# EAGLE schematic 2ndNov_submission_12V_everywhere (EAGLE 8.3.2)
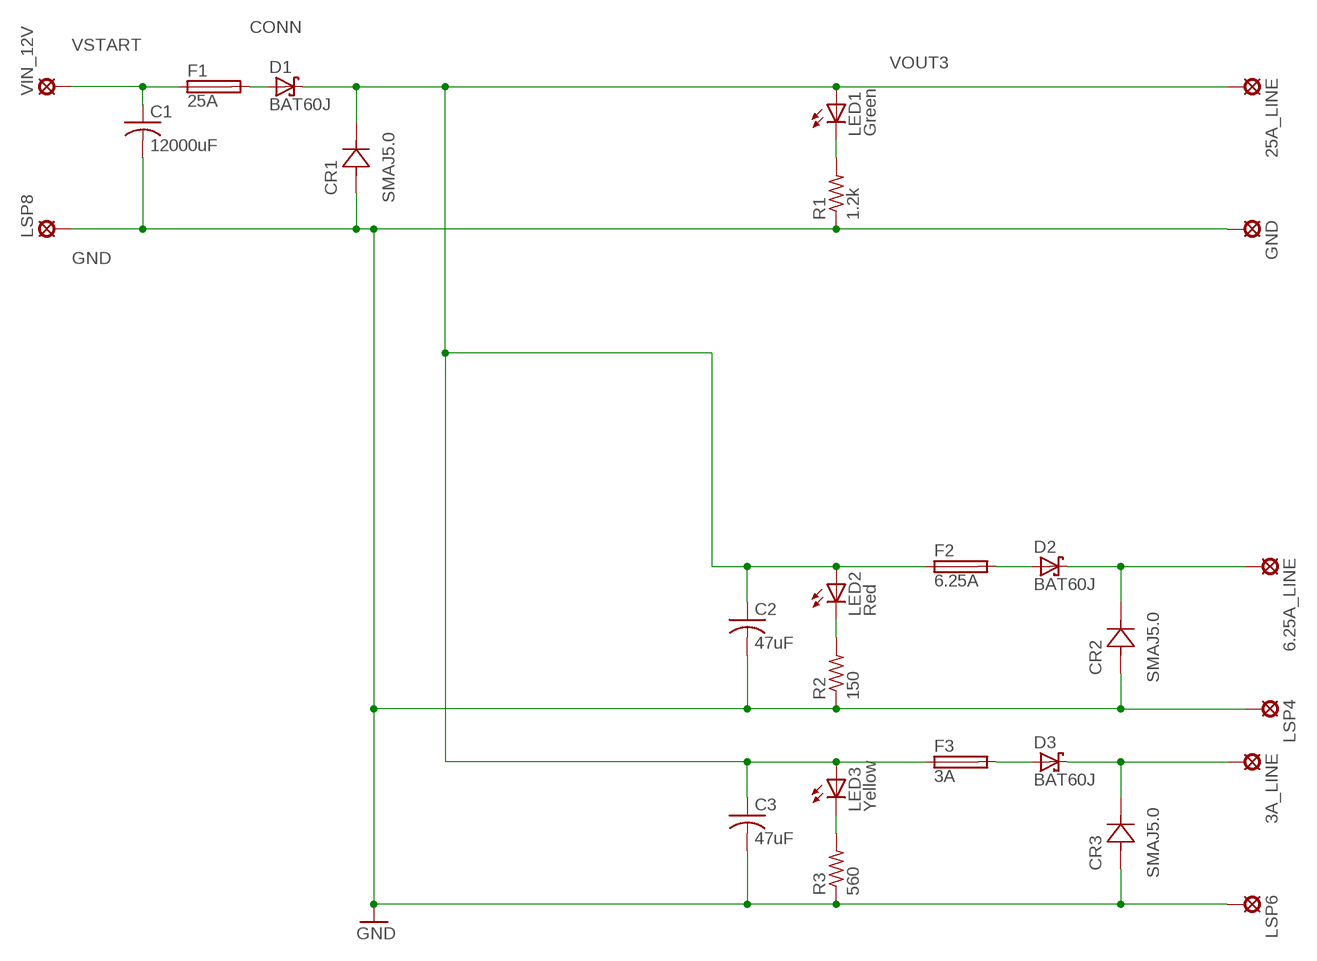
[diagram p0: schematic, sheet 1]

## Parts
3A_LINE  SE13  [SE13]
6.25A_LINE  SE13  [SE13]
25A_LINE  SE13  [SE13]
C1  12000uF  C-USC1206K  [C1206K]
C2  47uF  C-USC1206K  [C1206K]
C3  47uF  C-USC1206K  [C1206K]
CR1  SMAJ5.0  [SMASERIES]
CR2  SMAJ5.0  [SMASERIES]
CR3  SMAJ5.0  [SMASERIES]
D1  BAT60J  [SOD323_ST]
D2  BAT60J  [SOD323_ST]
D3  BAT60J  [SOD323_ST]
F1  25A  TE5  [TE5]
F2  6.25A  TE5  [TE5]
F3  3A  TE5  [TE5]
GND  SE13  [SE13]
LED1  Green  LEDCHIPLED_1206  [CHIPLED_1206]
LED2  Red  LEDCHIPLED_1206  [CHIPLED_1206]
LED3  Yellow  LEDCHIPLED_1206  [CHIPLED_1206]
LSP4  SE13  [SE13]
LSP6  SE13  [SE13]
LSP8  SE13  [SE13]
R1  1.2k  R-US_R1206  [R1206]
R2  150  R-US_R1206  [R1206]
R3  560  R-US_R1206  [R1206]
VIN_12V  SE13  [SE13]

## Nets
CONN: D1.A F1.2
GND: C1.2 C2.2 C3.2 CR1.2 CR2.2 CR3.2 GND.MP LSP4.MP LSP6.MP LSP8.MP R1.1 R2.1 R3.1
N$6: LED1.C R1.2
N$12: D2.A F2.2
N$13: 6.25A_LINE.MP CR2.1 D2.C
N$15: LED2.C R2.2
N$17: D3.A F3.2
N$18: 3A_LINE.MP CR3.1 D3.C
N$20: LED3.C R3.2
VOUT3: 25A_LINE.MP C2.1 C3.1 CR1.1 D1.C F2.1 F3.1 LED1.A LED2.A LED3.A
VSTART: C1.1 F1.1 VIN_12V.MP

## Library data of the parts
3A_LINE 6.25A_LINE 25A_LINE GND LSP4 LSP6 LSP8 VIN_12V = solpad:SE13: SOLDER PAD E1542, drill 1,3mm, distributor Buerklin, 07F815
C1-C3 = rcl:C-US: CAPACITOR, American symbol
CR1-CR3 = SMAJ5_diode:SMAJ5.0; MANUFACTURER_PART_NUMBER: SMAJ5.0; VENDOR: Littelfuse Inc
D1-D3 = diode:BAT60J: Schottky barrier diode Source: www.st.com, BAT60J.pdf
F1-F3 = fuse:TE5: FUSE Wickmann; OC_FARNELL: unknown; OC_NEWARK: unknown
LED1-LED3 = led:LED: LED OSRAM: - CHIPLED LG R971, LG N971, LY N971, LG Q971, LY Q971, LO R971, LY R971 LH N974, LH R974 LS Q976, LO Q976, LY Q976 LO Q996 - Hyper CHIPLED LW Q18S LB Q993, LB Q99A, LB R99A - SideLED LS A670, LO A670, LY A670, LG A670, LP A670 LB A673, LV A673, LT A673, LW A673 LH A674 LY A675 LS A676, LA A676, LO A676, LY A676, LW A676 LS A679, LY A679, LG A679 - Hyper Micro SIDELED® LS Y876, LA Y876, LO Y876, LY Y876 LT Y87S - SmartLED LW L88C, LW L88S LB L89C, LB L89S, LG L890 LS L89K, LO L89K, LY L89K LS L896, LA L896, LO L896, LY L896 - TOPLED LS T670, LO T670, LY T670, LG T670, LP T670 LSG T670, LSP T670, LSY T670, LOP T670, LYG T670 LG T671, LOG T671, LSG T671 LB T673, LV T673, LT T673, LW T673 LH T674 LS T676, LA T676, LO T676, LY T676, LB T676, LH T676, LSB T676, LW T676 LB T67C, LV T67C, LT T67C, LS T67K, LO T67K, LY T67K, LW E67C LS E67B, LA E67B, LO E67B, LY E67B, LB E67C, LV E67C, LT E67C LW T67C LS T679, LY T679, LG T679 LS T770, LO T770, LY T770, LG T770, LP T770 LB T773, LV T773, LT T773, LW T773 LH T774 LS E675, LA E675, LY E675, LS T675 LS T776, LA T776, LO T776, LY T776, LB T776 LHGB T686 LT T68C, LB T68C - Hyper Mini TOPLED® LB M676 - Mini TOPLED Santana® LG M470 LS M47K, LO M47K, LY M47K Source: http://www.osram.convergy.de LUXEON: - LUMILED® LXK2-PW12-R00, LXK2-PW12-S00, LXK2-PW14-U00, LXK2-PW14-V00 LXK2-PM12-R00, LXK2-PM12-S00, LXK2-PM14-U00 LXK2-PE12-Q00, LXK2-PE12-R00, LXK2-PE12-S00, LXK2-PE14-T00, LXK2-PE14-U00 LXK2-PB12-K00, LXK2-PB12-L00, LXK2-PB12-M00, LXK2-PB14-N00, LXK2-PB14-P00, LXK2-PB14-Q00 LXK2-PR12-L00, LXK2-PR12-M00, LXK2-PR14-Q00, LXK2-PR14-R00 LXK2-PD12-Q00, LXK2-PD12-R00, LXK2-PD12-S00 LXK2-PH12-R00, LXK2-PH12-S00 LXK2-PL12-P00, LXK2-PL12-Q00, LXK2-PL12-R00 Source: www.luxeon.com KINGBRIGHT: KA-3528ASYC Source: www.kingbright.com
R1-R3 = rcl:R-US_: RESISTOR, American symbol